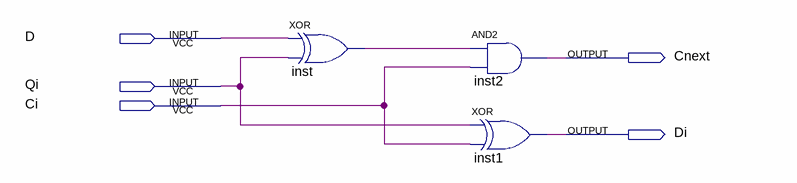
[diagram p0: schematic sheet]
// Quartus schematic HAS.bdf as structural Verilog: 3 symbols, 5 pins
module HAS (
  input  D,
  input  Qi,
  input  Ci,
  output Cnext,
  output Di
);

  wire inst_out;

  xor inst (inst_out, D, Qi);
  and inst2 (Cnext, inst_out, Ci);
  xor inst1 (Di, Qi, Ci);
endmodule
